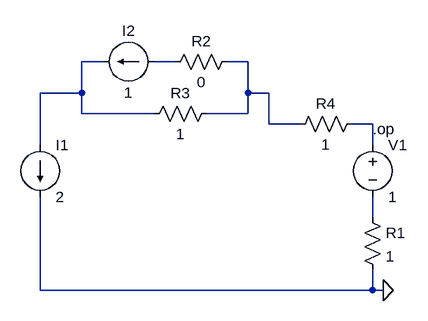
[diagram p0: schematic MixCSource_VSource_R.asc]
MixCSource_VSource_R.asc, the LTspice schematic file:
Version 4
SHEET 1 880 680
WIRE 176 224 144 224
WIRE 288 224 256 224
WIRE 400 224 368 224
WIRE 144 272 144 224
WIRE 144 272 80 272
WIRE 400 272 400 224
WIRE 432 272 400 272
WIRE 144 304 144 272
WIRE 256 304 144 304
WIRE 400 304 400 272
WIRE 400 304 336 304
WIRE 432 320 432 272
WIRE 480 320 432 320
WIRE 592 320 560 320
WIRE 80 352 80 272
WIRE 592 352 592 320
WIRE 592 464 592 432
WIRE 80 576 80 432
WIRE 592 576 592 544
WIRE 592 576 80 576
WIRE 608 576 592 576
FLAG 608 576 0
SYMBOL current 80 352 R0
SYMATTR InstName I1
SYMATTR Value 2
SYMBOL current 256 224 R90
WINDOW 0 -32 40 VBottom 2
WINDOW 3 32 40 VTop 2
SYMATTR InstName I2
SYMATTR Value 1
SYMBOL voltage 592 336 R0
SYMATTR InstName V1
SYMATTR Value 1
SYMBOL res 576 448 R0
SYMATTR InstName R1
SYMATTR Value 1
SYMBOL res 384 208 R90
WINDOW 0 0 56 VBottom 2
WINDOW 3 32 56 VTop 2
SYMATTR InstName R2
SYMATTR Value 0
SYMBOL res 352 288 R90
WINDOW 0 0 56 VBottom 2
WINDOW 3 32 56 VTop 2
SYMATTR InstName R3
SYMATTR Value 1
SYMBOL res 576 304 R90
WINDOW 0 0 56 VBottom 2
WINDOW 3 32 56 VTop 2
SYMATTR InstName R4
SYMATTR Value 1
TEXT 592 328 Left 2 !.op

The netlist it stands for:
* MixCSource_VSource_R.asc
I1 N001 0 2
I2 N002 N001 1
V1 N004 N005 1
R1 N005 0 1
R2 N003 N002 0
R3 N003 N001 1
R4 N004 N003 1
.op
.backanno
.end